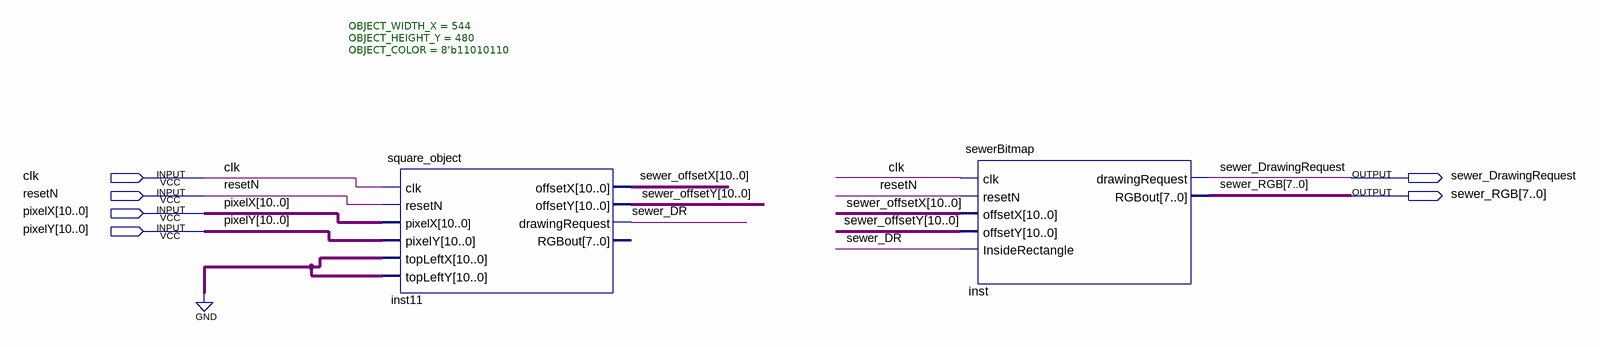
[diagram p0: schematic sheet]
// Quartus schematic SEWER_DISPLAY.bdf as structural Verilog: 2 symbols, 6 pins
module SEWER_DISPLAY (
  input  clk,
  input  resetN,
  input  [10:0] pixelX,
  input  [10:0] pixelY,
  output sewer_DrawingRequest,
  output [7:0] sewer_RGB
);

  wire sewer_DR;
  wire [10:0] sewer_offsetX, sewer_offsetY;

  square_object #(.OBJECT_WIDTH_X(544), .OBJECT_HEIGHT_Y(480), .OBJECT_COLOR(8'b11010110)) inst11 (
    .clk(clk), .resetN(resetN), .pixelX(pixelX), .pixelY(pixelY), .topLeftX({11{1'b0}}),
    .topLeftY({11{1'b0}}), .offsetX(sewer_offsetX), .offsetY(sewer_offsetY), .drawingRequest(sewer_DR));  // open: RGBout
  sewerBitmap inst (
    .clk(clk), .resetN(resetN), .offsetX(sewer_offsetX), .offsetY(sewer_offsetY), .InsideRectangle(sewer_DR),
    .drawingRequest(sewer_DrawingRequest), .RGBout(sewer_RGB));
endmodule
